# EAGLE design untitled (EAGLE 6.5.0)
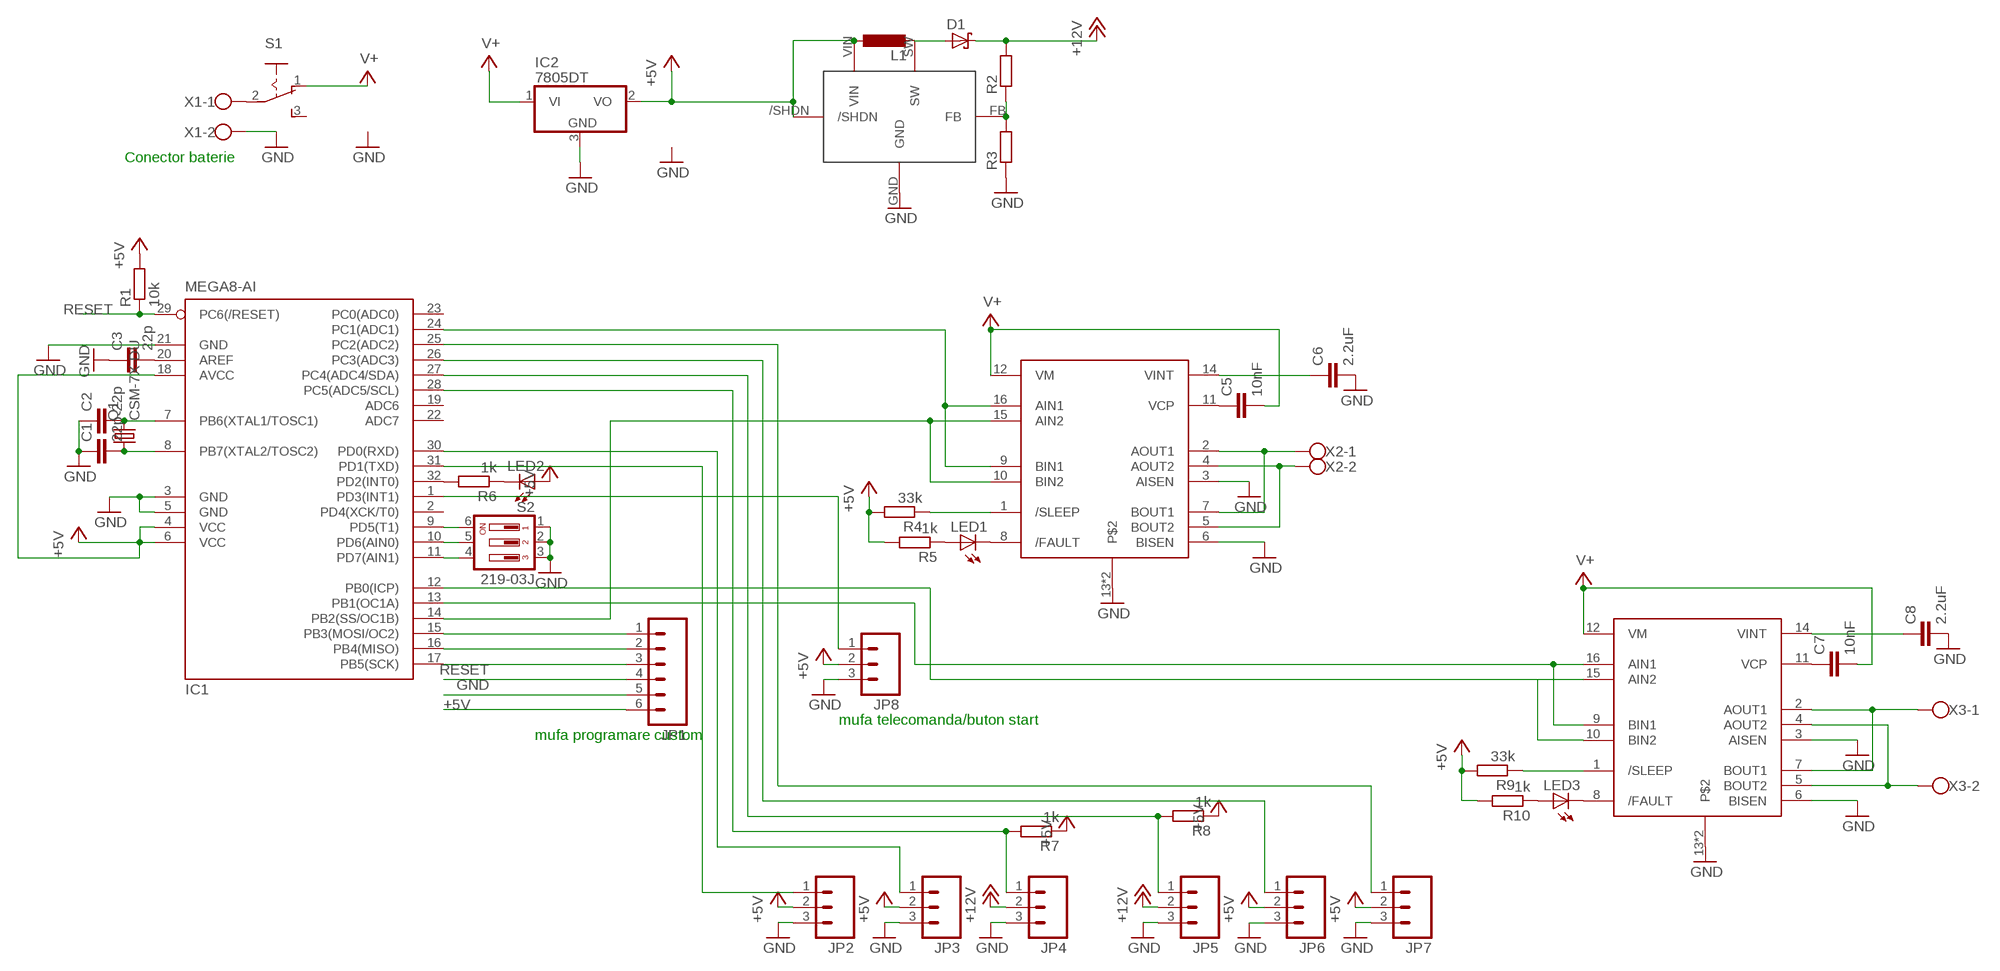
[diagram p0: schematic, sheet 1]

## Parts
C1  22p  C-EUC0805  [C0805]
C2  22p  C-EUC0805  [C0805]
C3  22p  C-EUC0805  [C0805]
C5  10nF  C-EUC0805  [C0805]
C6  2.2uF  C-EUC0805  [C0805]
C7  10nF  C-EUC0805  [C0805]
C8  2.2uF  C-EUC0805  [C0805]
D1  SCHOTTKY-DIODESMD  [SMB]
IC1  MEGA8-AI  [TQFP32-08]
IC2  7805DT  [TO252]
JP1  M06SIP  [1X06]
JP2  M03PTH  [1X03]
JP3  M03PTH  [1X03]
JP4  M03PTH  [1X03]
JP5  M03PTH  [1X03]
JP6  M03PTH  [1X03]
JP7  M03PTH  [1X03]
JP8  M03PTH  [1X03]
L1  L-EUL4532C  [L4532M]
LED1  LEDSML0805  [SML0805]
LED2  LEDSML0805  [SML0805]
LED3  LEDSML0805  [SML0805]
Q1  CSM-7X-DU  [CSM-7X-DU]
R1  10k  R-EU_R0805  [R0805]
R2  R-EU_R0805  [R0805]
R3  R-EU_R0805  [R0805]
R4  33k  R-EU_R0805  [R0805]
R5  1k  R-EU_R0805  [R0805]
R6  1k  R-EU_R0805  [R0805]
R7  1k  R-EU_R0805  [R0805]
R8  1k  R-EU_R0805  [R0805]
R9  33k  R-EU_R0805  [R0805]
R10  1k  R-EU_R0805  [R0805]
S1  255SB  [255SB]
S2  219-03J  [CTS-219-03J]
U$1  LM2703  [SOT23]
U$2  DRV8833-PWP  [PW]
U$3  DRV8833-PWP  [PW]
X1  W237-102  [W237-102]
X2  W237-102  [W237-102]
X3  W237-102  [W237-102]

## Nets
+5V: IC1.4(VCC) IC1.6(VCC) IC1.18(AVCC) IC2.2(VO) JP1.6 JP2.2 JP3.2 JP6.2 JP7.2 JP8.2 L1.1 LED2.A R1.2 R4.2 R5.2 R7.1 R8.1 R9.2 R10.2 U$1./SHDN U$1.VIN
+12V: D1.C JP4.2 JP5.2 R2.2
GND: C1.1 C2.1 C3.1 C6.2 C8.2 IC1.3(GND) IC1.5(GND) IC1.21(GND) IC2.3(GND) JP1.5 JP2.3 JP3.3 JP4.3 JP5.3 JP6.3 JP7.3 JP8.3 R3.1 S2.1 S2.2 S2.3 U$1.GND U$2.3(AISEN) U$2.6(BISEN) U$2.13 U$2.PAD U$3.3(AISEN) U$3.6(BISEN) U$3.13 U$3.PAD X1.2
N$1: C2.2 IC1.7(PB6(XTAL1/TOSC1)) Q1.2
N$2: C1.2 IC1.8(PB7(XTAL2/TOSC2)) Q1.1
N$3: S1.2(P) X1.1
N$4: IC1.17(PB5(SCK)) JP1.3
N$5: IC1.16(PB4(MISO)) JP1.2
N$6: IC1.15(PB3(MOSI/OC2)) JP1.1
N$7: D1.A L1.2 U$1.SW
N$8: R4.1 U$2.1(/SLEEP)
N$9: R2.1 R3.2 U$1.FB
N$10: LED1.C U$2.8(/FAULT)
N$11: LED1.A R5.1
N$12: U$2.2(AOUT1) U$2.7(BOUT1) X2.1
N$13: U$2.4(AOUT2) U$2.5(BOUT2) X2.2
N$14: R9.1 U$3.1(/SLEEP)
N$15: LED3.C U$3.8(/FAULT)
N$16: C5.1 U$2.11(VCP)
N$17: C6.1 U$2.14(VINT)
N$18: IC1.12(PB0(ICP)) U$3.10(BIN2) U$3.15(AIN2)
N$19: IC1.24(PC1(ADC1)) U$2.9(BIN1) U$2.16(AIN1)
N$20: IC1.13(PB1(OC1A)) U$3.9(BIN1) U$3.16(AIN1)
N$21: IC1.14(PB2(SS/OC1B)) U$2.10(BIN2) U$2.15(AIN2)
N$22: IC1.9(PD5(T1)) S2.6
N$23: IC1.10(PD6(AIN0)) S2.5
N$24: IC1.11(PD7(AIN1)) S2.4
N$25: IC1.1(PD3(INT1)) JP8.1
N$26: IC1.31(PD1(TXD)) JP2.1
N$27: IC1.30(PD0(RXD)) JP3.1
N$28: IC1.28(PC5(ADC5/SCL)) JP4.1 R7.2
N$29: IC1.27(PC4(ADC4/SDA)) JP5.1 R8.2
N$30: IC1.26(PC3(ADC3)) JP6.1
N$31: IC1.25(PC2(ADC2)) JP7.1
N$32: IC1.32(PD2(INT0)) R6.2
N$33: LED2.C R6.1
N$34: LED3.A R10.1
N$35: C7.1 U$3.11(VCP)
N$36: C8.1 U$3.14(VINT)
N$38: C3.2 IC1.20(AREF)
N$39: U$3.4(AOUT2) U$3.5(BOUT2) X3.2
N$40: U$3.2(AOUT1) U$3.7(BOUT1) X3.1
RESET: IC1.29(PC6(/RESET)) JP1.4 R1.1
V+: C5.2 C7.2 IC2.1(VI) S1.1(O) U$2.12(VM) U$3.12(VM)
Unconnected: IC1.2(PD4(XCK/T0)) IC1.19(ADC6) IC1.22(ADC7) IC1.23(PC0(ADC0)) S1.3(S)

## Notes on the sheet
- Conector baterie
- mufa telecomanda/buton start
- mufa programare custom

## Library data of the parts
C1-C3 C5-C8 = resistor:C-EU: CAPACITOR, European symbol
D1 = diode:SCHOTTKY-DIODE: Schottky Diode
IC1 = atmel:MEGA8: MICROCONTROLLER 8 Kbytes FLASH, 1 kbytes SRAM, 512 bytes EEPROM, USART, 6-channel 10 bit ADC, 2-channel 8 bit ADC Pin compatible with Atmega48, ATMega88, ATMega168 Source: avr.lbr; MPN: ATMEGA8-16AU; OC_FARNELL: 9171371; OC_NEWARK: 73M8863
IC2 = linear:78*: Positive VOLTAGE REGULATOR Source: http://cache.national.com/ds/LM/LM78L05.pdf http://www.fairchildsemi.com/ds/LM/LM7805.pdf
JP1 = SparkFun-Connectors:M06: Header 6 Standard 6-pin 0.1" header. Use with straight break away headers (SKU : PRT-00116), right angle break away headers (PRT-00553), swiss pins (PRT-00743), machine pins (PRT-00117), and female headers (PRT-00115). Molex polarized connector foot print use with SKU : PRT-08094 with associated crimp pins and housings. NOTES ON THE VARIANTS LOCK and LOCK_LONGPADS... This footprint was designed to help hold the alignment of a through-hole component (i.e. 6-pin header) while soldering it into place. You may notice that each hole has been shifted either up or down by 0.005 of an inch from it's more standard position (which is a perfectly straight line). This slight alteration caused the pins (the squares in the middle) to touch the edges of the holes. Because they are alternating, it causes a "brace" to hold the component in place. 0.005 has proven to be the perfect amount of "off-center" position when using our standard breakaway headers. Although looks a little odd when you look at the bare footprint, once you have a header in there, the alteration is very hard to notice. Also,if you push a header all the way into place, it is covered up entirely on the bottom side. This idea of altering the position of holes to aid alignment will be further integrated into the Sparkfun Library for other footprints. It can help hold any component with 3 or more connection pins.
JP2-JP8 = SparkFun-Connectors:M03: Header 3 Standard 3-pin 0.1" header. Use with straight break away headers (SKU : PRT-00116), right angle break away headers (PRT-00553), swiss pins (PRT-00743), machine pins (PRT-00117), and female headers (PRT-00115). Molex polarized connector foot print use with SKU : PRT-08232 with associated crimp pins and housings.
L1 = resistor:L-EU: INDUCTOR, European symbol
LED1-LED3 = led:LED: LED OSRAM: - CHIPLED LG R971, LG N971, LY N971, LG Q971, LY Q971, LO R971, LY R971 LH N974, LH R974 LS Q976, LO Q976, LY Q976 LO Q996 - Hyper CHIPLED LW Q18S LB Q993, LB Q99A, LB R99A - SideLED LS A670, LO A670, LY A670, LG A670, LP A670 LB A673, LV A673, LT A673, LW A673 LH A674 LY A675 LS A676, LA A676, LO A676, LY A676, LW A676 LS A679, LY A679, LG A679 - Hyper Micro SIDELED® LS Y876, LA Y876, LO Y876, LY Y876 LT Y87S - SmartLED LW L88C, LW L88S LB L89C, LB L89S, LG L890 LS L89K, LO L89K, LY L89K LS L896, LA L896, LO L896, LY L896 - TOPLED LS T670, LO T670, LY T670, LG T670, LP T670 LSG T670, LSP T670, LSY T670, LOP T670, LYG T670 LG T671, LOG T671, LSG T671 LB T673, LV T673, LT T673, LW T673 LH T674 LS T676, LA T676, LO T676, LY T676, LB T676, LH T676, LSB T676, LW T676 LB T67C, LV T67C, LT T67C, LS T67K, LO T67K, LY T67K, LW E67C LS E67B, LA E67B, LO E67B, LY E67B, LB E67C, LV E67C, LT E67C LW T67C LS T679, LY T679, LG T679 LS T770, LO T770, LY T770, LG T770, LP T770 LB T773, LV T773, LT T773, LW T773 LH T774 LS E675, LA E675, LY E675, LS T675 LS T776, LA T776, LO T776, LY T776, LB T776 LHGB T686 LT T68C, LB T68C - Hyper Mini TOPLED® LB M676 - Mini TOPLED Santana® LG M470 LS M47K, LO M47K, LY M47K Source: http://www.osram.convergy.de LUXEON: - LUMILED® LXK2-PW12-R00, LXK2-PW12-S00, LXK2-PW14-U00, LXK2-PW14-V00 LXK2-PM12-R00, LXK2-PM12-S00, LXK2-PM14-U00 LXK2-PE12-Q00, LXK2-PE12-R00, LXK2-PE12-S00, LXK2-PE14-T00, LXK2-PE14-U00 LXK2-PB12-K00, LXK2-PB12-L00, LXK2-PB12-M00, LXK2-PB14-N00, LXK2-PB14-P00, LXK2-PB14-Q00 LXK2-PR12-L00, LXK2-PR12-M00, LXK2-PR14-Q00, LXK2-PR14-R00 LXK2-PD12-Q00, LXK2-PD12-R00, LXK2-PD12-S00 LXK2-PH12-R00, LXK2-PH12-S00 LXK2-PL12-P00, LXK2-PL12-Q00, LXK2-PL12-R00 Source: www.luxeon.com KINGBRIGHT: KA-3528ASYC Source: www.kingbright.com
Q1 = crystal:CSM-7X-DU: SMD CRYSTAL Source: www.ecsxtal.com .. Crystal 3.6864MHz CSM_7X_DU.PDF; OC_FARNELL: unknown; OC_NEWARK: unknown
R1-R10 = resistor:R-EU_: RESISTOR, European symbol
S1 = switch:255SB: SLIDING SWITCH Distributor Buerklin, 11G810
S2 = switch-dil:219-03*: Surface Mount DIP Switch Series 219 SMT CTS Electronic Components Sourc: www.ctscorp.com; OC_FARNELL: unknown; OC_NEWARK: unknown
U$1 = lm2703mf:LM2703
U$2 U$3 = drv8833:DRV8833-PWP
X1-X3 = con-wago-500:W237-102: WAGO SCREW CLAMP; MPN: 237-102; OC_FARNELL: unknown; OC_NEWARK: 70K9898

## Board
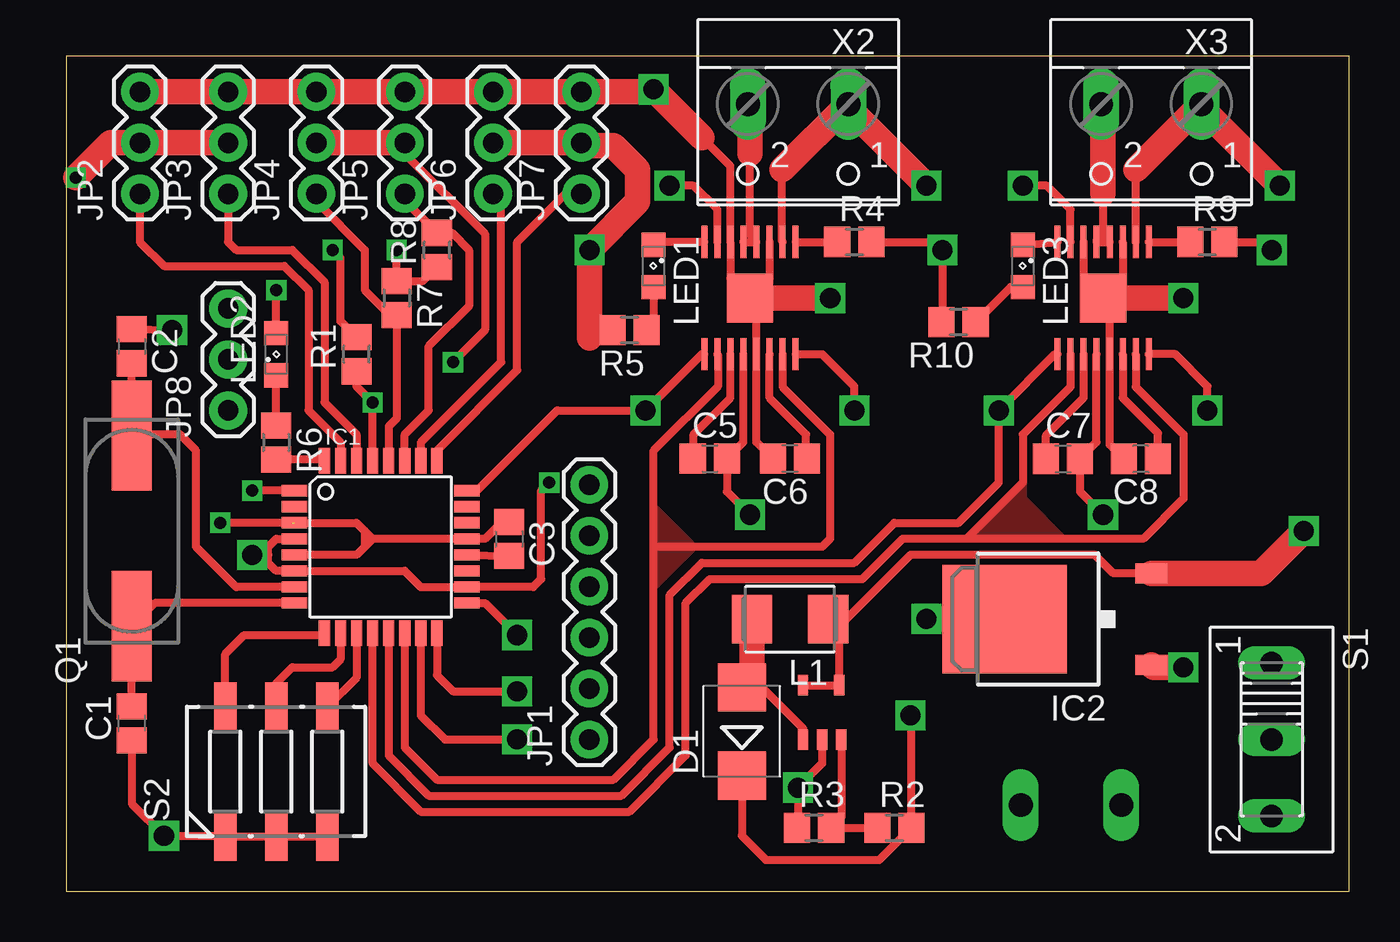
[diagram p1: board, top side]
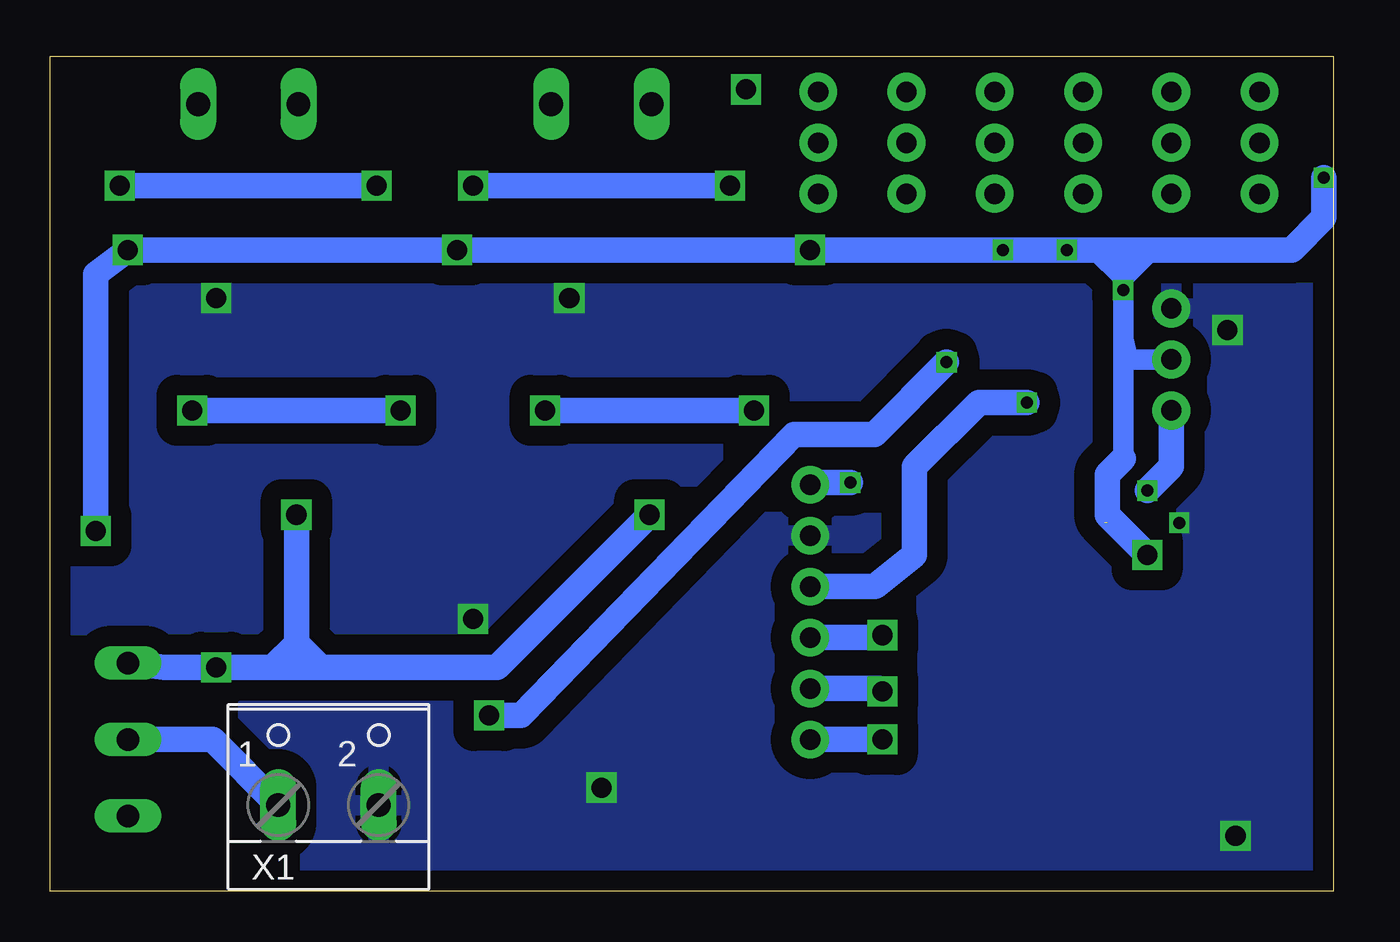
[diagram p2: board, bottom side, seen from below]

Size 63.93 x 41.62 mm. Coordinates in mm from the lower left corner, seen from the top.
Outline: 0,0 63.93,0 63.93,41.62 0,41.62 0,0
Copper layers (1*16): Top 0.035mm / dielectric 1.5mm / Bottom 0.035mm
Design rules "default": minimum track width 10mil, minimum drill 24mil, track to track 8mil, track to pad 8mil, pad to pad 8mil, via to via 8mil, smd to smd 8mil, copper to edge 40mil, drill to drill 8mil, minimum pad ring 10mil, minimum via ring 8mil, stop-mask expansion 4mil, vias tented up to drill 0mil, thermal gap 10mil

### Footprints (pad centres in the part's own frame; a part is rotated, then mirrored left to right if it is on the bottom)
C0805 = smd 1.3 x 1.5: 1 -0.85,0; 2 0.85,0
SMB = smd 2.4 x 2.4: A 2.2,0; C -2.2,0
TQFP32-08 = smd 1.27 x 0.559: 1 -4.293,2.8; 2 -4.293,2; 3 -4.293,1.2; 4 -4.293,0.4; 5 -4.293,-0.4; 6 -4.293,-1.2; 7 -4.293,-2; 8 -4.293,-2.8; 17 4.293,-2.8; 18 4.293,-2; 19 4.293,-1.2; 20 4.293,-0.4; 21 4.293,0.4; 22 4.293,1.2; 23 4.293,2; 24 4.293,2.8 | smd 0.559 x 1.27: 9 -2.8,-4.293; 10 -2,-4.293; 11 -1.2,-4.293; 12 -0.4,-4.293; 13 0.4,-4.293; 14 1.2,-4.293; 15 2,-4.293; 16 2.8,-4.293; 25 2.8,4.293; 26 2,4.293; 27 1.2,4.293; 28 0.4,4.293; 29 -0.4,4.293; 30 -1.2,4.293; 31 -2,4.293; 32 -2.8,4.293
TO252 = smd 1 x 1.6: 1 -2.28,-4.8; 2 2.28,-4.8 | smd 5.4 x 6.2: 3 0,2.5
1X06 = drill 1.016 pad 1.88: 1 0,0; 2 2.54,0; 3 5.08,0; 4 7.62,0; 5 10.16,0; 6 12.7,0
1X03 = drill 1.016 pad 1.88: 1 0,0; 2 2.54,0; 3 5.08,0
L4532M = smd 2 x 2.4: 1 -1.9,0; 2 1.9,0
SML0805 = smd 1.2 x 1.2: A 1.05,0; C -1.05,0
CSM-7X-DU = smd 5.5 x 2: 1 -4.75,0; 2 4.75,0
R0805 = smd 1.3 x 1.5: 1 -0.85,0; 2 0.85,0
255SB = drill 1.118 long: 1 -3.81,0; 2 0,0; 3 3.81,0
CTS-219-03J = smd 1.13 x 2.44: 1 -2.54,-3.215; 2 0,-3.215; 3 2.54,-3.215; 4 2.54,3.215; 5 0,3.215; 6 -2.54,3.215
SOT23 = smd 0.508 x 1.016: /SHDN 0.85,2.7; FB 0.95,0; GND 0,0; SW -0.95,0; VIN -0.95,2.7
PW = smd 0.3 x 1.6: 1 2.275,2.8; 2 1.625,2.8; 3 0.975,2.8; 4 0.325,2.8; 5 -0.325,2.8; 6 -0.975,2.8; 7 -1.625,2.8; 8 -2.275,2.8; 9 -2.275,-2.8; 10 -1.625,-2.8; 11 -0.975,-2.8; 12 -0.325,-2.8; 13 0.325,-2.8; 14 0.975,-2.8; 15 1.625,-2.8; 16 2.275,-2.8 | smd 2.31 x 2.46: PAD 0,0
W237-102 = drill 1.194 long: 1 -2.5,-1.27; 2 2.5,-1.27

### Placement (x,y rotation side)
C1  3.26,8.37 90 top
C2  3.26,27.17 270 top
C3  22.06,17.57 270 top
C5  32.06,21.57 0 top
C6  36.06,21.57 180 top
C7  49.66,21.56 0 top
C8  53.54,21.56 180 top
D1  33.66,7.97 90 top
IC1  15.66,17.17 0 top
IC2  49.26,13.57 90 top
JP1  26.06,7.57 90 top
JP2  3.66,34.77 90 top
JP3  8.06,34.77 90 top
JP4  12.46,34.77 90 top
JP5  16.86,34.77 90 top
JP6  21.26,34.77 90 top
JP7  25.66,34.77 90 top
JP8  8.06,23.97 90 top
L1  36.06,13.57 180 top
LED1  29.26,31.17 270 top
LED2  10.46,26.77 90 top
LED3  47.66,31.17 270 top
Q1  3.26,17.97 90 top
R1  14.46,26.77 90 top
R2  41.26,3.17 0 top
R3  37.26,3.17 0 top
R4  39.26,32.37 0 top
R5  28.06,27.97 180 top
R6  10.46,22.37 270 top
R7  16.46,29.57 270 top
R8  18.46,31.97 90 top
R9  56.86,32.37 0 top
R10  44.46,28.37 180 top
S1  60.06,7.57 270 top
S2  10.46,5.97 0 top
U$1  37.66,7.57 0 top
U$2  34.06,29.57 0 top
U$3  51.66,29.57 0 top
X1  50.06,5.57 0 bottom
X2  36.46,37.97 180 top
X3  54.06,37.97 180 top

### Tracks (layer width: path | path; a pad name or v marks a point on that pad's centre or on a via)
+5V  (via drill 0.6, 1, 1 pad 1.5)
  Top 0.406: 10.06,16.77 10.06,16.37 10.46,15.97 IC1.6 16.86,15.97 17.66,15.17 IC1.18 23.26,15.17 23.66,15.57 23.66,19.97 v24.06,20.37 | 10.06,16.77 10.06,17.17 10.46,17.57 IC1.4 | U$1.VIN U$1./SHDN 38.51,13.02 L1.1 38.86,13.57 42.06,16.77 51.26,16.77 52.18,15.85 IC2.2 | v9.26,16.77 10.06,16.77 | R1.2 13.66,28.42 13.66,31.57 v13.26,31.97 | v16.46,31.97 R7.1 17.76,30.42 R8.1 | LED2.A v10.46,29.97 | R5.2 26.46,27.97 26.06,27.57 | R4.2 43.26,32.37 v43.66,31.97 43.66,28.42 R10.2 | R9.2 59.66,32.37 v60.06,31.97
  Top 1.27: JP6.2 JP7.2 25.8,37.17 27.26,37.17 28.46,35.97 28.46,34.37 v26.06,31.97 26.06,27.57 | JP3.2 JP2.2 2.2,37.31 v0.46,35.57 | IC2.2 59.54,15.85 v61.66,17.97
  Bottom 0.406: 25.96,20.37 JP1.6
  Bottom 1.016: 10.46,21.57 10.46,27.57 | 10.46,27.57 v10.46,29.97 10.46,30.77 10.46,31.97 | JP8.2 10.2,26.51 10.46,27.57
  Bottom 1.27: 14.46,31.97 v16.46,31.97 | v16.46,31.97 v26.06,31.97 v43.66,31.97 v60.06,31.97 61.66,30.77 v61.66,17.97 | v9.26,16.77 11.26,18.77 11.26,20.77 10.46,21.57 | v0.46,35.57 0.46,33.57 2.06,31.97 9.26,31.97 | 9.26,31.97 10.46,31.97 11.66,31.97 | 11.66,31.97 v13.26,31.97 v16.46,31.97 | 11.66,31.97 10.46,30.77 9.26,31.97 | v24.06,20.37 25.96,20.37
+12V  (via drill 0.6 pad 1, 1)
  Top 0.406: JP5.2 16.86,36.77 20.86,32.77 20.86,27.97 v19.26,26.37 | D1.C 33.66,2.77 34.86,1.57 40.51,1.57 R2.2 42.11,8.72 v42.06,8.77
  Top 1.27: JP4.2 JP5.2
  Bottom 1.27: v19.26,26.37 22.86,22.77 26.86,22.77 40.46,8.77 v42.06,8.77
GND  (via drill 0.6, 0.6 pad 1, 1, 1 pad 1.5)  (1 unrouted)
  Top 0.406: 15.26,17.57 IC1.21 20.86,17.57 21.71,18.42 C3.1 | 15.26,17.57 14.86,17.17 | 14.86,17.17 14.46,16.77 IC1.5 | IC1.3 14.46,18.37 14.86,17.97 | 14.86,17.97 15.26,17.57 | U$2.PAD 34.38,29.25 U$2.13 34.38,22.39 C6.2 | U$2.3 35.03,30.55 U$2.PAD | U$2.PAD 33.09,30.55 U$2.6 33.09,36.14 31.66,37.57 | S2.3 S2.2 S2.1 4.88,2.75 v4.86,2.77 3.26,4.37 C1.1 | 11.26,18.37 v7.66,18.37 | C2.1 v5.26,27.97 | 14.86,17.97 14.86,17.17 | C8.2 51.98,22.27 U$3.13 51.98,29.17 | 51.98,29.17 51.98,29.25 U$3.PAD 50.68,30.55 U$3.6 | U$3.3 52.63,29.82 51.98,29.17 | U$1.GND 37.66,6.37 v36.46,5.17 36.46,3.22 R3.1
  Top 1.27: IC2.3 v42.86,13.57 | U$2.PAD v38.06,29.57 | JP7.3 JP6.3 JP5.3 JP4.3 JP3.3 JP2.3 29.14,39.85 v29.26,39.97 31.66,37.57 | v55.66,29.57 U$3.PAD
  pour Bottom (isolate 1.016, rank 3): 0.06,-0.03 0.06,41.57 64.06,41.57 64.06,-0.03
  cutout Bottom (isolate 0.406, rank 2): 0.86,41.57 1.26,33.17 33.66,32.77 33.26,41.17
N$1
  Top 0.406: IC1.7 8.46,15.17 6.46,17.17 6.46,21.97 5.66,22.77 3.31,22.77 | 3.31,22.77 Q1.2 | 3.31,22.77 C2.2
N$2
  Top 0.406: IC1.8 4.41,14.37 Q1.1 C1.2
N$3
  Bottom 1.27: S1.2 55.83,7.57 X1.1
N$4  (via drill 1 pad 1.5)
  Top 0.406: IC1.17 20.86,14.37 v22.46,12.77
  Bottom 1.27: JP1.3 22.58,12.65 v22.46,12.77
N$5  (via drill 1 pad 1.5)
  Top 0.406: IC1.16 18.46,10.77 19.26,9.97 v22.46,9.97
  Bottom 1.27: JP1.2 22.6,10.11 v22.46,9.97
N$6  (via drill 1 pad 1.5)
  Top 0.406: IC1.15 17.66,8.77 18.86,7.57 v22.46,7.57
  Bottom 1.27: v22.46,7.57 JP1.1
N$7
  Top 0.406: U$1.SW 36.71,8.12 34.16,10.67
  Top 1.27: L1.2 34.16,10.67 D1.A
N$8
  Top 0.406: U$2.1 R4.1
N$9
  Top 0.406: U$1.FB 38.61,3.67 R3.2 R2.1
N$10
  Top 0.406: U$2.8 29.41,32.37 LED1.C
N$11
  Top 0.406: LED1.A 29.26,28.32 R5.1
N$12  (via drill 1)
  Top 0.406: U$2.7 32.43,33.99 31.26,35.17 v30.06,35.17 | U$2.2 35.66,32.39 35.66,35.97
  Top 1.27: v42.86,35.17 38.96,39.07 X2.1 38.96,39.27 35.66,35.97
  Bottom 1.27: v30.06,35.17 v42.86,35.17
N$13
  Top 0.406: U$2.5 U$2.4 33.96,32.79 34.06,32.89 34.06,36.77
  Top 1.27: 34.06,36.77 34.06,39.14 X2.2
N$14
  Top 0.406: U$3.1 R9.1
N$15
  Top 0.406: LED3.C U$3.8
N$16
  Top 0.406: C5.1 31.26,21.62 31.26,22.77 33.09,24.6 U$2.11
N$17
  Top 0.406: C6.1 36.86,21.62 36.86,22.77 35.03,24.6 U$2.14
N$18
  Top 0.406: IC1.12 15.26,6.37 17.66,3.97 28.06,3.97 30.86,6.77 30.86,14.37 32.06,15.57 39.66,15.57 41.66,17.57 44.86,17.57 | U$3.10 50.03,25.14 47.66,22.77 47.66,20.37 44.86,17.57 | U$3.15 53.28,25.14 55.66,22.77 55.66,19.57 53.66,17.57 44.86,17.57
  pour Top: 44.86,17.57 47.66,20.37 47.66,19.57 49.66,17.57
N$19  (via drill 1)
  Top 0.406: v39.26,23.97 39.26,25.17 37.66,26.77 U$2.16 | U$2.9 31.66,26.77 v28.86,23.97 24.46,23.97 20.46,19.97 IC1.24
  Bottom 1.27: v28.86,23.97 v39.26,23.97
N$20  (via drill 1)
  Top 0.406: IC1.13 16.06,6.77 18.06,4.77 27.66,4.77 30.06,7.17 30.06,14.77 31.66,16.37 39.26,16.37 41.26,18.37 44.46,18.37 46.46,20.37 v46.46,23.97 49.26,26.77 U$3.9 | v56.86,23.97 56.86,25.17 55.26,26.77 U$3.16
  Bottom 1.27: v46.46,23.97 v56.86,23.97
N$21
  Top 0.406: IC1.14 16.86,7.17 18.46,5.57 27.26,5.57 29.26,7.57 29.26,17.17 | 29.26,17.17 29.26,21.97 32.46,25.17 32.46,26.75 U$2.10 | U$2.15 35.68,25.14 38.06,22.77 38.06,17.57 37.66,17.17 29.26,17.17
  pour Top: 29.26,15.17 31.26,17.17 29.26,19.17
N$22
  Top 0.406: S2.6 7.92,11.83 8.86,12.77 12.75,12.77 IC1.9
N$23
  Top 0.406: IC1.10 13.66,11.57 13.26,11.17 11.26,11.17 10.46,10.37 S2.5
N$24
  Top 0.406: IC1.11 14.46,10.64 S2.4
N$25  (via drill 0.6 pad 1)
  Top 0.406: IC1.1 v9.26,19.97
  Bottom 1.27: JP8.1 8.06,21.17 v9.26,19.97
N$26
  Top 0.406: JP2.1 3.66,32.37 4.86,31.17 10.86,31.17 12.06,29.97 12.06,23.97 13.66,22.37 IC1.31
N$27
  Top 0.406: JP3.1 8.06,32.37 8.46,31.97 11.26,31.97 12.86,30.37 12.86,24.37 14.46,22.77 IC1.30
N$28
  Top 0.406: JP4.1 12.46,34.37 14.86,31.97 14.86,29.97 16.06,28.77 16.41,28.77 R7.2 16.46,23.57 16.06,23.17 IC1.28
N$29
  Top 0.406: IC1.27 16.86,22.77 18.06,23.97 18.06,27.17 20.06,29.17 20.06,31.97 19.21,32.82 R8.2 16.86,34.42 JP5.1
N$30
  Top 0.406: IC1.26 17.66,22.37 21.66,26.37 21.66,34.37 JP6.1
N$31
  Top 0.406: IC1.25 18.46,21.97 22.46,25.97 22.46,32.37 24.86,34.77 JP7.1 25.26,34.77
N$32
  Top 0.406: IC1.32 12.8,21.52 R6.2
N$33
  Top 0.406: R6.1 LED2.C
N$34
  Top 0.406: LED3.A 47.06,30.12 R10.1
N$35
  Top 0.406: C7.1 48.81,22.72 50.68,24.6 U$3.11
N$36
  Top 0.406: C8.1 54.39,22.84 52.63,24.6 U$3.14
N$38
  Top 0.406: IC1.20 C3.2
N$39
  Top 0.406: 51.56,32.79 U$3.4 U$3.5 51.34,32.45 51.66,32.77 51.66,34.77
  Top 1.27: X3.2 51.66,39.14 51.66,34.77
N$40  (via drill 1)
  Top 0.406: U$3.2 53.28,35.96 | U$3.7 50.03,33.99 48.86,35.17 v47.66,35.17
  Top 1.27: v60.46,35.17 56.56,39.07 X3.1 53.28,35.96
  Bottom 1.27: v47.66,35.17 v60.46,35.17
N$43  (via drill 1)
  other vias: 30.06,35.17
RESET  (via drill 0.6 pad 1)
  Top 0.406: IC1.29 v15.26,24.37 14.46,25.17 R1.1
  Bottom 1.27: v15.26,24.37 17.66,24.37 20.86,21.17 20.86,16.77 22.84,15.19 JP1.4
V+  (via drill 1, 1 pad 1.5)
  Top 0.406: U$2.12 33.73,22.39 C5.2 32.91,19.92 v34.06,18.77 | U$3.12 51.34,22.39 C7.2 50.51,19.92 v51.66,18.77
  Top 1.27: v55.66,11.17 54.18,11.17 IC2.1
  Bottom 1.27: 50.46,11.17 41.66,11.17 v34.06,18.77 | 50.46,11.17 51.26,11.17 | 51.26,11.17 52.86,11.17 | 52.86,11.17 v55.66,11.17 58.25,11.17 S1.1 | v51.66,18.77 51.66,12.37 | 51.66,12.37 51.66,11.57 51.26,11.17 | 51.66,12.37 50.46,11.17 | 51.66,12.37 52.86,11.17